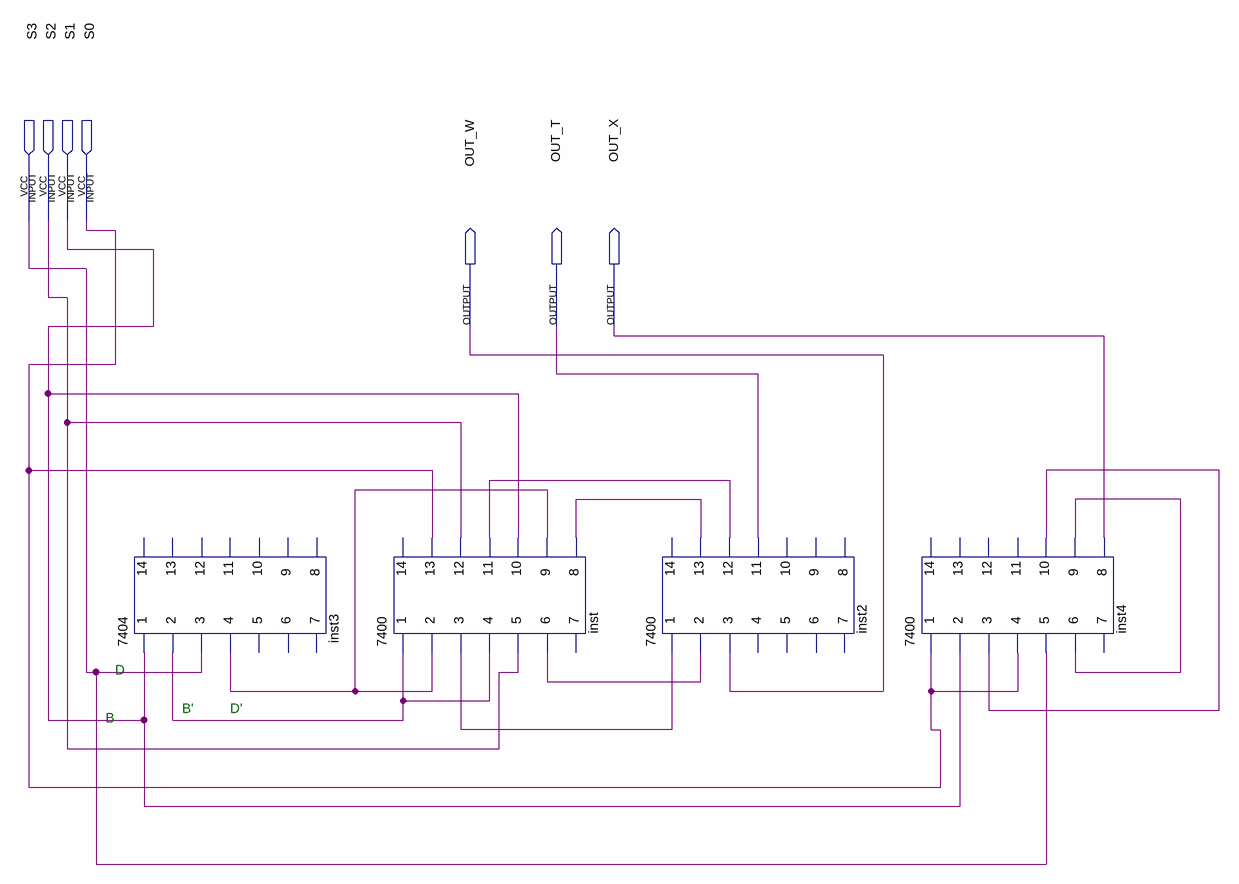
[diagram p0: schematic sheet]
// Quartus schematic BCD_chip_level_reference.bdf as structural Verilog: 4 symbols, 7 pins
module BCD_chip_level_reference (
  input  S3,
  input  S2,
  input  S1,
  input  S0,
  output OUT_W,
  output OUT_T,
  output OUT_X
);

  wire inst3_2, inst3_4, inst4_3, inst4_6, inst_3, inst_6, inst_8, inst_11;

  \7404  inst3 (.\1 (S1), .\3 (S3), .\2 (inst3_2), .\4 (inst3_4));  // open: 7, 14, 5, 9, 11, 13, 6, 8, 10, 12
  \7400  inst (
    .\1 (inst3_2), .\2 (inst3_4), .\4 (inst3_2), .\5 (S2), .\9 (inst3_4), .\10 (S1), .\12 (S2), .\13 (S0),
    .\3 (inst_3), .\6 (inst_6), .\8 (inst_8), .\11 (inst_11));  // open: 7, 14
  \7400  inst2 (
    .\1 (inst_3), .\2 (inst_6), .\12 (inst_11), .\13 (inst_8), .\3 (OUT_W), .\11 (OUT_T));  // open: 7, 14, 4, 5, 9, 10, 6, 8
  \7400  inst4 (
    .\1 (S0), .\2 (S1), .\4 (S0), .\5 (S3), .\9 (inst4_6), .\10 (inst4_3), .\3 (inst4_3), .\6 (inst4_6),
    .\8 (OUT_X));  // open: 7, 14, 12, 13, 11

  // Notes on the sheet:
  //   D
  //   B'
  //   D'
  //   B
endmodule
